# Altium schematic sheet LED_Ring.SchDoc: LED Ring
size A; Engineer: Bob Adams; Revision: AC; SheetNumber: 1; SheetTotal: 1
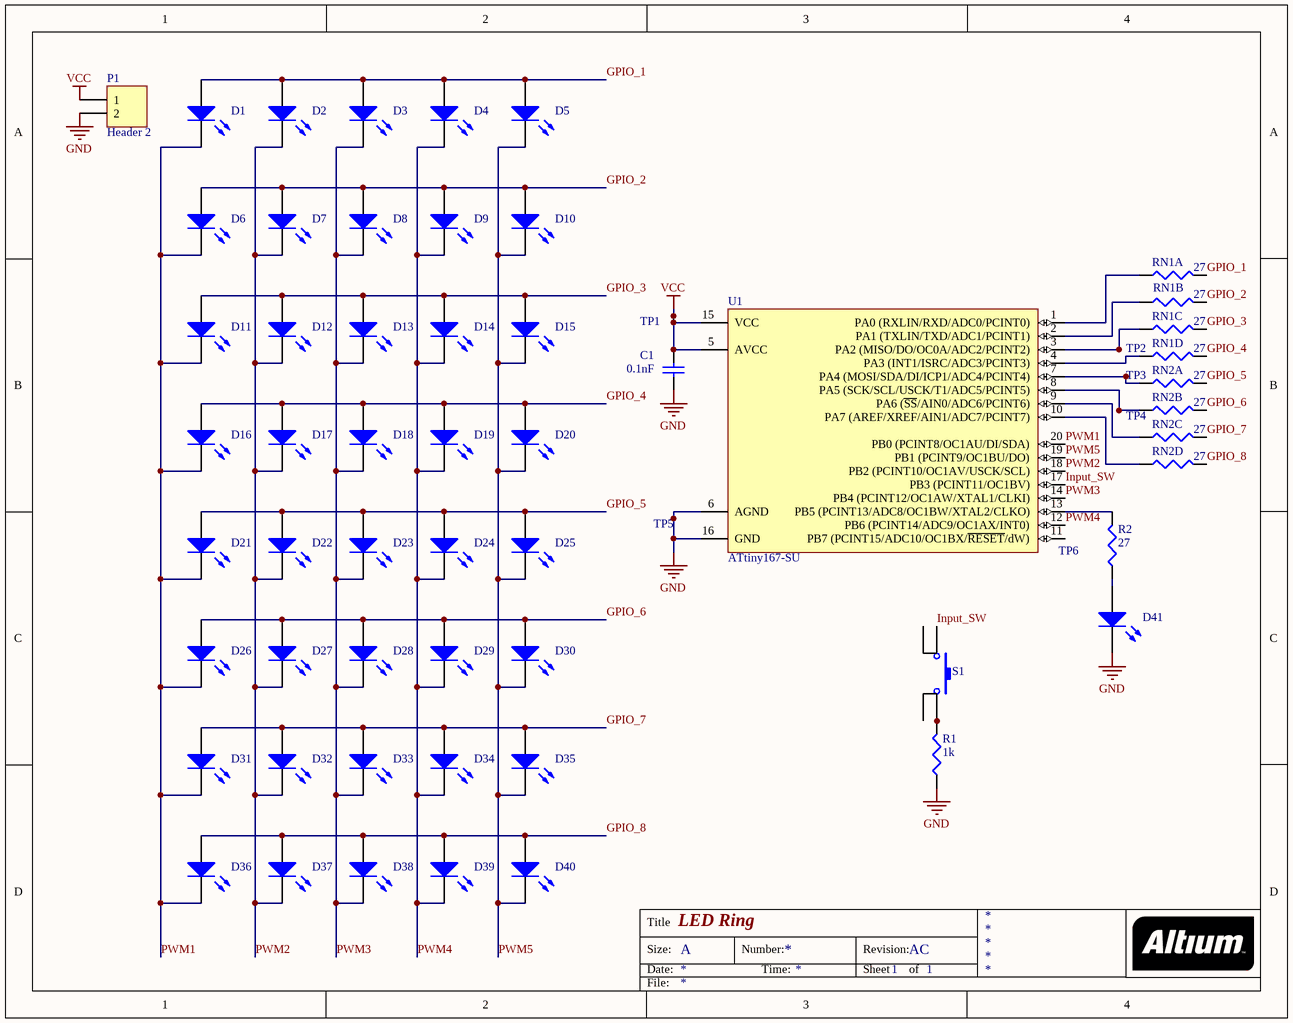
[diagram p0: LED_Ring.SchDoc]

## Parts
C1  value 0.1nF  [1608[0603]]  (hidden comment: Cap Semi)
D1  475-1410-1-ND  [0805]  (value not drawn)
D2  475-1410-1-ND  [0805]  (value not drawn)
D3  475-1410-1-ND  [0805]  (value not drawn)
D4  475-1410-1-ND  [0805]  (value not drawn)
D5  475-1410-1-ND  [0805]  (value not drawn)
D6  475-1410-1-ND  [0805]  (value not drawn)
D7  475-1410-1-ND  [0805]  (value not drawn)
D8  475-1410-1-ND  [0805]  (value not drawn)
D9  475-1410-1-ND  [0805]  (value not drawn)
D10  475-1410-1-ND  [0805]  (value not drawn)
D11  475-1410-1-ND  [0805]  (value not drawn)
D12  475-1410-1-ND  [0805]  (value not drawn)
D13  475-1410-1-ND  [0805]  (value not drawn)
D14  475-1410-1-ND  [0805]  (value not drawn)
D15  475-1410-1-ND  [0805]  (value not drawn)
D16  475-1410-1-ND  [0805]  (value not drawn)
D17  475-1410-1-ND  [0805]  (value not drawn)
D18  475-1410-1-ND  [0805]  (value not drawn)
D19  475-1410-1-ND  [0805]  (value not drawn)
D20  475-1410-1-ND  [0805]  (value not drawn)
D21  475-1410-1-ND  [0805]  (value not drawn)
D22  475-1410-1-ND  [0805]  (value not drawn)
D23  475-1410-1-ND  [0805]  (value not drawn)
D24  475-1410-1-ND  [0805]  (value not drawn)
D25  475-1410-1-ND  [0805]  (value not drawn)
D26  475-1410-1-ND  [0805]  (value not drawn)
D27  475-1410-1-ND  [0805]  (value not drawn)
D28  475-1410-1-ND  [0805]  (value not drawn)
D29  475-1410-1-ND  [0805]  (value not drawn)
D30  475-1410-1-ND  [0805]  (value not drawn)
D31  475-1410-1-ND  [0805]  (value not drawn)
D32  475-1410-1-ND  [0805]  (value not drawn)
D33  475-1410-1-ND  [0805]  (value not drawn)
D34  475-1410-1-ND  [0805]  (value not drawn)
D35  475-1410-1-ND  [0805]  (value not drawn)
D36  475-1410-1-ND  [0805]  (value not drawn)
D37  475-1410-1-ND  [0805]  (value not drawn)
D38  475-1410-1-ND  [0805]  (value not drawn)
D39  475-1410-1-ND  [0805]  (value not drawn)
D40  475-1410-1-ND  [0805]  (value not drawn)
D41  475-1410-1-ND  [0805]  (value not drawn)
P1  Header 2  [HDR1X2]
R1  1k  [RC0805]
R2  27  [RC0805]
RN1  value 27  [4x0603]  (hidden comment: YC164J-27CT-ND)  (parts A,B,C,D of 4)
RN2  value 27  [4x0603]  (hidden comment: YC164J-27CT-ND)  (parts A,B,C,D of 4)
S1  OFF-MOM switch, 10mA  [EG4793-ND]  (value not drawn)
TP1  TP  [TP]  (value not drawn)
TP2  TP  [TP]  (value not drawn)
TP3  TP  [TP]  (value not drawn)
TP4  TP  [TP]  (value not drawn)
TP5  TP  [TP]  (value not drawn)
TP6  TP  [TP]  (value not drawn)
U1  ATtiny167-SU  [20S2_N]

## Nets
GND: C1.1 D41.2(K) P1.2 R1.1 TP5.1 U1.6(AGND) U1.16(GND)
VCC: C1.2 P1.1 TP1.1 U1.5(AVCC) U1.15(VCC)
GPIO_1: D1.1(A) D2.1(A) D3.1(A) D4.1(A) D5.1(A) RN1.2
GPIO_2: D6.1(A) D7.1(A) D8.1(A) D9.1(A) D10.1(A) RN1.4
GPIO_3: D11.1(A) D12.1(A) D13.1(A) D14.1(A) D15.1(A) RN1.6
GPIO_4: D16.1(A) D17.1(A) D18.1(A) D19.1(A) D20.1(A) RN1.8
GPIO_5: D21.1(A) D22.1(A) D23.1(A) D24.1(A) D25.1(A) RN2.2
GPIO_6: D26.1(A) D27.1(A) D28.1(A) D29.1(A) D30.1(A) RN2.4
GPIO_7: D31.1(A) D32.1(A) D33.1(A) D34.1(A) D35.1(A) RN2.6
GPIO_8: D36.1(A) D37.1(A) D38.1(A) D39.1(A) D40.1(A) RN2.8
Input_SW: S1.1 U1.17(PB3_(PCINT11/OC1BV))
PWM1: D1.2(K) D6.2(K) D11.2(K) D16.2(K) D21.2(K) D26.2(K) D31.2(K) D36.2(K) U1.20(PB0_(PCINT8/OC1AU/DI/SDA))
PWM2: D2.2(K) D7.2(K) D12.2(K) D17.2(K) D22.2(K) D27.2(K) D32.2(K) D37.2(K) U1.18(PB2_(PCINT10/OC1AV/USCK/SCL))
PWM3: D3.2(K) D8.2(K) D13.2(K) D18.2(K) D23.2(K) D28.2(K) D33.2(K) D38.2(K) U1.14(PB4_(PCINT12/OC1AW/XTAL1/CLKI))
PWM4: D4.2(K) D9.2(K) D14.2(K) D19.2(K) D24.2(K) D29.2(K) D34.2(K) D39.2(K) U1.12(PB6_(PCINT14/ADC9/OC1AX/INT0))
PWM5: D5.2(K) D10.2(K) D15.2(K) D20.2(K) D25.2(K) D30.2(K) D35.2(K) D40.2(K) U1.19(PB1_(PCINT9/OC1BU/DO))
NetD41_1: D41.1(A) R2.1
NetR1_2: R1.2 S1.2
NetR2_2: R2.2 U1.13(PB5_(PCINT13/ADC8/OC1BW/XTAL2/CLKO))
NetRN1_1: RN1.1 U1.1(PA0_(RXLIN/RXD/ADC0/PCINT0))
NetRN1_3: RN1.3 U1.2(PA1_(TXLIN/TXD/ADC1/PCINT1))
NetRN1_5: RN1.5 TP2.1 U1.3(PA2_(MISO/DO/OC0A/ADC2/PCINT2))
NetRN1_7: RN1.7 U1.4(PA3_(INT1/ISRC/ADC3/PCINT3))
NetRN2_1: RN2.1 TP3.1 U1.7(PA4_(MOSI/SDA/DI/ICP1/ADC4/PCINT4))
NetRN2_3: RN2.3 TP4.1 U1.8(PA5_(SCK/SCL/USCK/T1/ADC5/PCINT5))
NetRN2_5: RN2.5 U1.9(PA6_(~{SS}/AIN0/ADC6/PCINT6))
NetRN2_7: RN2.7 U1.10(PA7_(AREF/XREF/AIN1/ADC7/PCINT7))
NetTP6_1: TP6.1 U1.11(PB7_(PCINT15/ADC10/OC1BX/~{RESET}/dW))

Not connected (* = marked no-connect by the designer): S1 3 4

## Notes on the sheet
- Title
- Size:
- Date:
- A
- Number:
- Time:
- Revision:
- Sheet
- of
- File:

## Library data of the parts
C1 = Cap Semi: Capacitor (Semiconductor SIM Model); Published: 8-Jun-2000; LatestRevisionDate: 29-May-2009; LatestRevisionNote: IPC-7351 Footprint Added.; PackageReference: C1206; Publisher: Altium Limited; PackageDescription: Chip Capacitor
D1-D41 = 475-1410-1-ND: OSRAM LG R971-KN-1, 0805, Green; Published: 8-Jun-2000; LatestRevisionDate: 08-Jul-2005; LatestRevisionNote: Mech Layer 1 removed.; PackageReference: LED-1; Publisher: Altium Limited; PackageDescription: LED; 2 Leads; Supplier 1: Digi-Key; Supplier 2: Digi-Key; Supplier 3: Digi-Key; Supplier Part Number 1: 475-1410-2-ND; Supplier Part Number 2: 475-1410-1-ND; Supplier Part Number 3: 475-1410-6-ND
P1 = Header 2: Header, 2-Pin; LatestRevisionDate: 17-Jul-2002; LatestRevisionNote: Re-released for DXP Platform.; Publisher: Altium Limited
R1 = RC0805FR-071KL: RES SMD 1K OHM 1% 1/8W 0805; Manufacturer: Yageo; Power (Watts): 0.125W, 1/8W; Temperature Coefficient: ±100ppm/°C; Supplier 1: Digi-Key; Manufacturer Part Number: RC0805FR-071KL; RoHS: RoHS Compliant; Category: Resistors; Stock 1: 6101780; Pricing 1: 1=0.1, 10=0.021, 25=0.0152, 100=0.0084, 250=0.00644, 500=0.00514, 1000=0.00379, 2500=0.00329 (USD); Packaging: Cut Tape (CT); Resistance (Ohms): 1k; Tolerance: ±1%; Composition: Thick Film; Features: Moisture Resistant; Operating Temperature: -55°C ~ 155°C; Package / Case: 0805 (2012 Metric); Supplier Device Package: 0805; Size / Dimension: 0.079" L x 0.049" W (2.00mm x 1.25mm); Height: 0.024" (0.60mm); Number of Terminations: 2; ComponentLink1URL: http://media.digikey.com/pdf/Data%20Sheets/Yageo%20PDFs/RC0805%20Pb%20Free.pdf; ComponentLink1Description: http://media.digikey.com/pdf/Data%20Sheets/Yageo%20PDFs/RC0805%20Pb%20Free.pdf; Supplier Part Number 1: 311-1.00KCRCT-ND
R2 = RC0805FR-0727RL: RES SMD 27 OHM 1% 1/8W 0805; Manufacturer: Yageo; Power (Watts): 0.125W, 1/8W; Temperature Coefficient: ±100ppm/°C; Supplier 1: Digi-Key; Manufacturer Part Number: RC0805FR-0727RL; RoHS: RoHS Compliant; Category: Resistors; Stock 1: 130529; Pricing 1: 1=0.1, 10=0.021, 25=0.0152, 100=0.0084, 250=0.00644, 500=0.00514, 1000=0.00379, 2500=0.00329 (USD); Packaging: Cut Tape (CT); Resistance (Ohms): 27; Tolerance: ±1%; Composition: Thick Film; Features: Moisture Resistant; Operating Temperature: -55°C ~ 155°C; Package / Case: 0805 (2012 Metric); Supplier Device Package: 0805; Size / Dimension: 0.079" L x 0.049" W (2.00mm x 1.25mm); Height: 0.024" (0.60mm); Number of Terminations: 2; ComponentLink1URL: http://media.digikey.com/pdf/Data%20Sheets/Yageo%20PDFs/RC0805%20Pb%20Free.pdf; ComponentLink1Description: http://media.digikey.com/pdf/Data%20Sheets/Yageo%20PDFs/RC0805%20Pb%20Free.pdf; Supplier Part Number 1: 311-27.0CRCT-ND
RN1 RN2 = YC164J-27CT-ND: Resistor Network; Published: 25-Nov-2014; LatestRevisionDate: 25-Nov-2014; LatestRevisionNote: YC164 Yageo 4xArray pattern; PackageReference: 4xArray; Publisher: Bob Adams; PackageDescription: Chip Resistor
S1 = OFF-MOM switch, 10mA: EG4793-ND; Published: 24-Mar-1999; LatestRevisionDate: 17-Jul-2002; LatestRevisionNote: Re-released for DXP Platform.; PackageReference: SPST-2; Publisher: Altium Limited; PackageDescription: Switch; 2 Leads
U1 = ATtiny167-SU: 8-bit AVR Microcontroller, LIN Controller, 1.8-5.5V, 20MHz, 16KB Flash, 512 Bytes EEPROM, 512 Bytes SRAM, 20-pin SOIC, Industrial Grade (-40°C to 85°C); DatasheetVersion: revB, Sep-2010; PackageVersion: revB, Nov-2006; PackageReference: 20S2; PackageDescription: 20-lead, 0.300" Wide Body, Plastic Gull Wing Small Outline Package (SOIC); Code_JEDEC: MS-013-AC; Code_IPC: SOIC127P1030-20; ComponentLink1Description: Manufacturer URL; ComponentLink1URL: http://www.atmel.com/; ComponentLink2Description: ATtiny87/167 Datasheet; ComponentLink2URL: http://www.atmel.com/dyn/resources/prod_documents/doc8265.pdf; ComponentLink3Description: ATtiny87/167 Summary; ComponentLink3URL: http://www.atmel.com/dyn/resources/prod_documents/8265S.pdf